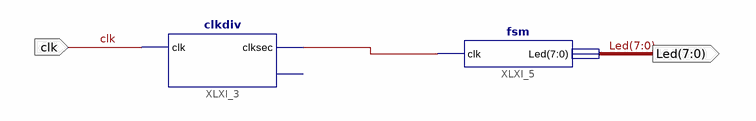
[diagram p0: schematic sheet 1]
// Xilinx ISE schematic toplevel.sch (spartan3e) as structural Verilog: 2 symbols, 2 ports
module toplevel (
  input  clk,
  output [7:0] Led
);

  wire XLXN_2;

  clkdiv XLXI_3 (.clk(clk), .clksec(XLXN_2));  // open: clk190
  fsm XLXI_5 (.clk(XLXN_2), .Led(Led));
endmodule
